# EAGLE design T05_version11_9 (EAGLE 7.1.0)
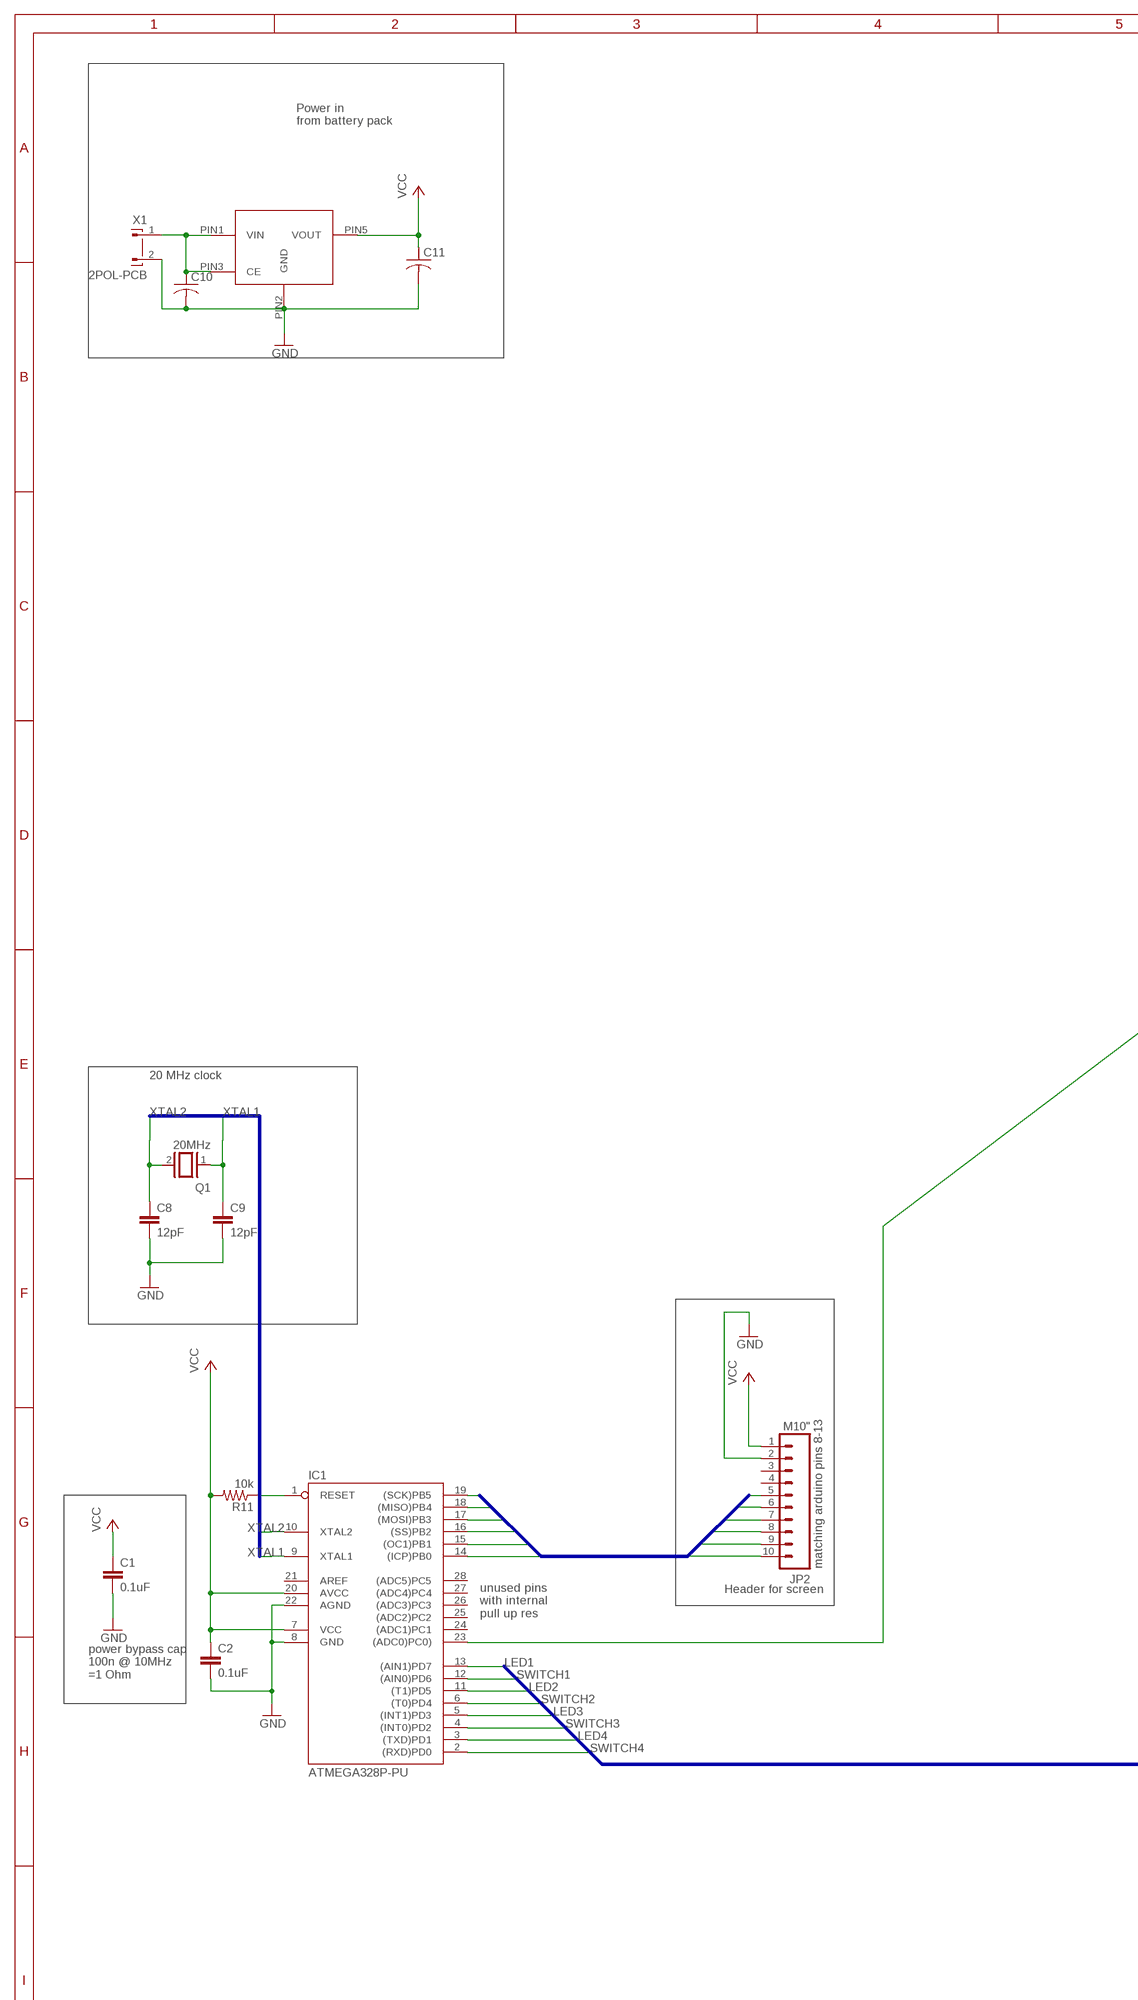
[diagram p0: schematic, sheet 1, part 1 of 2]
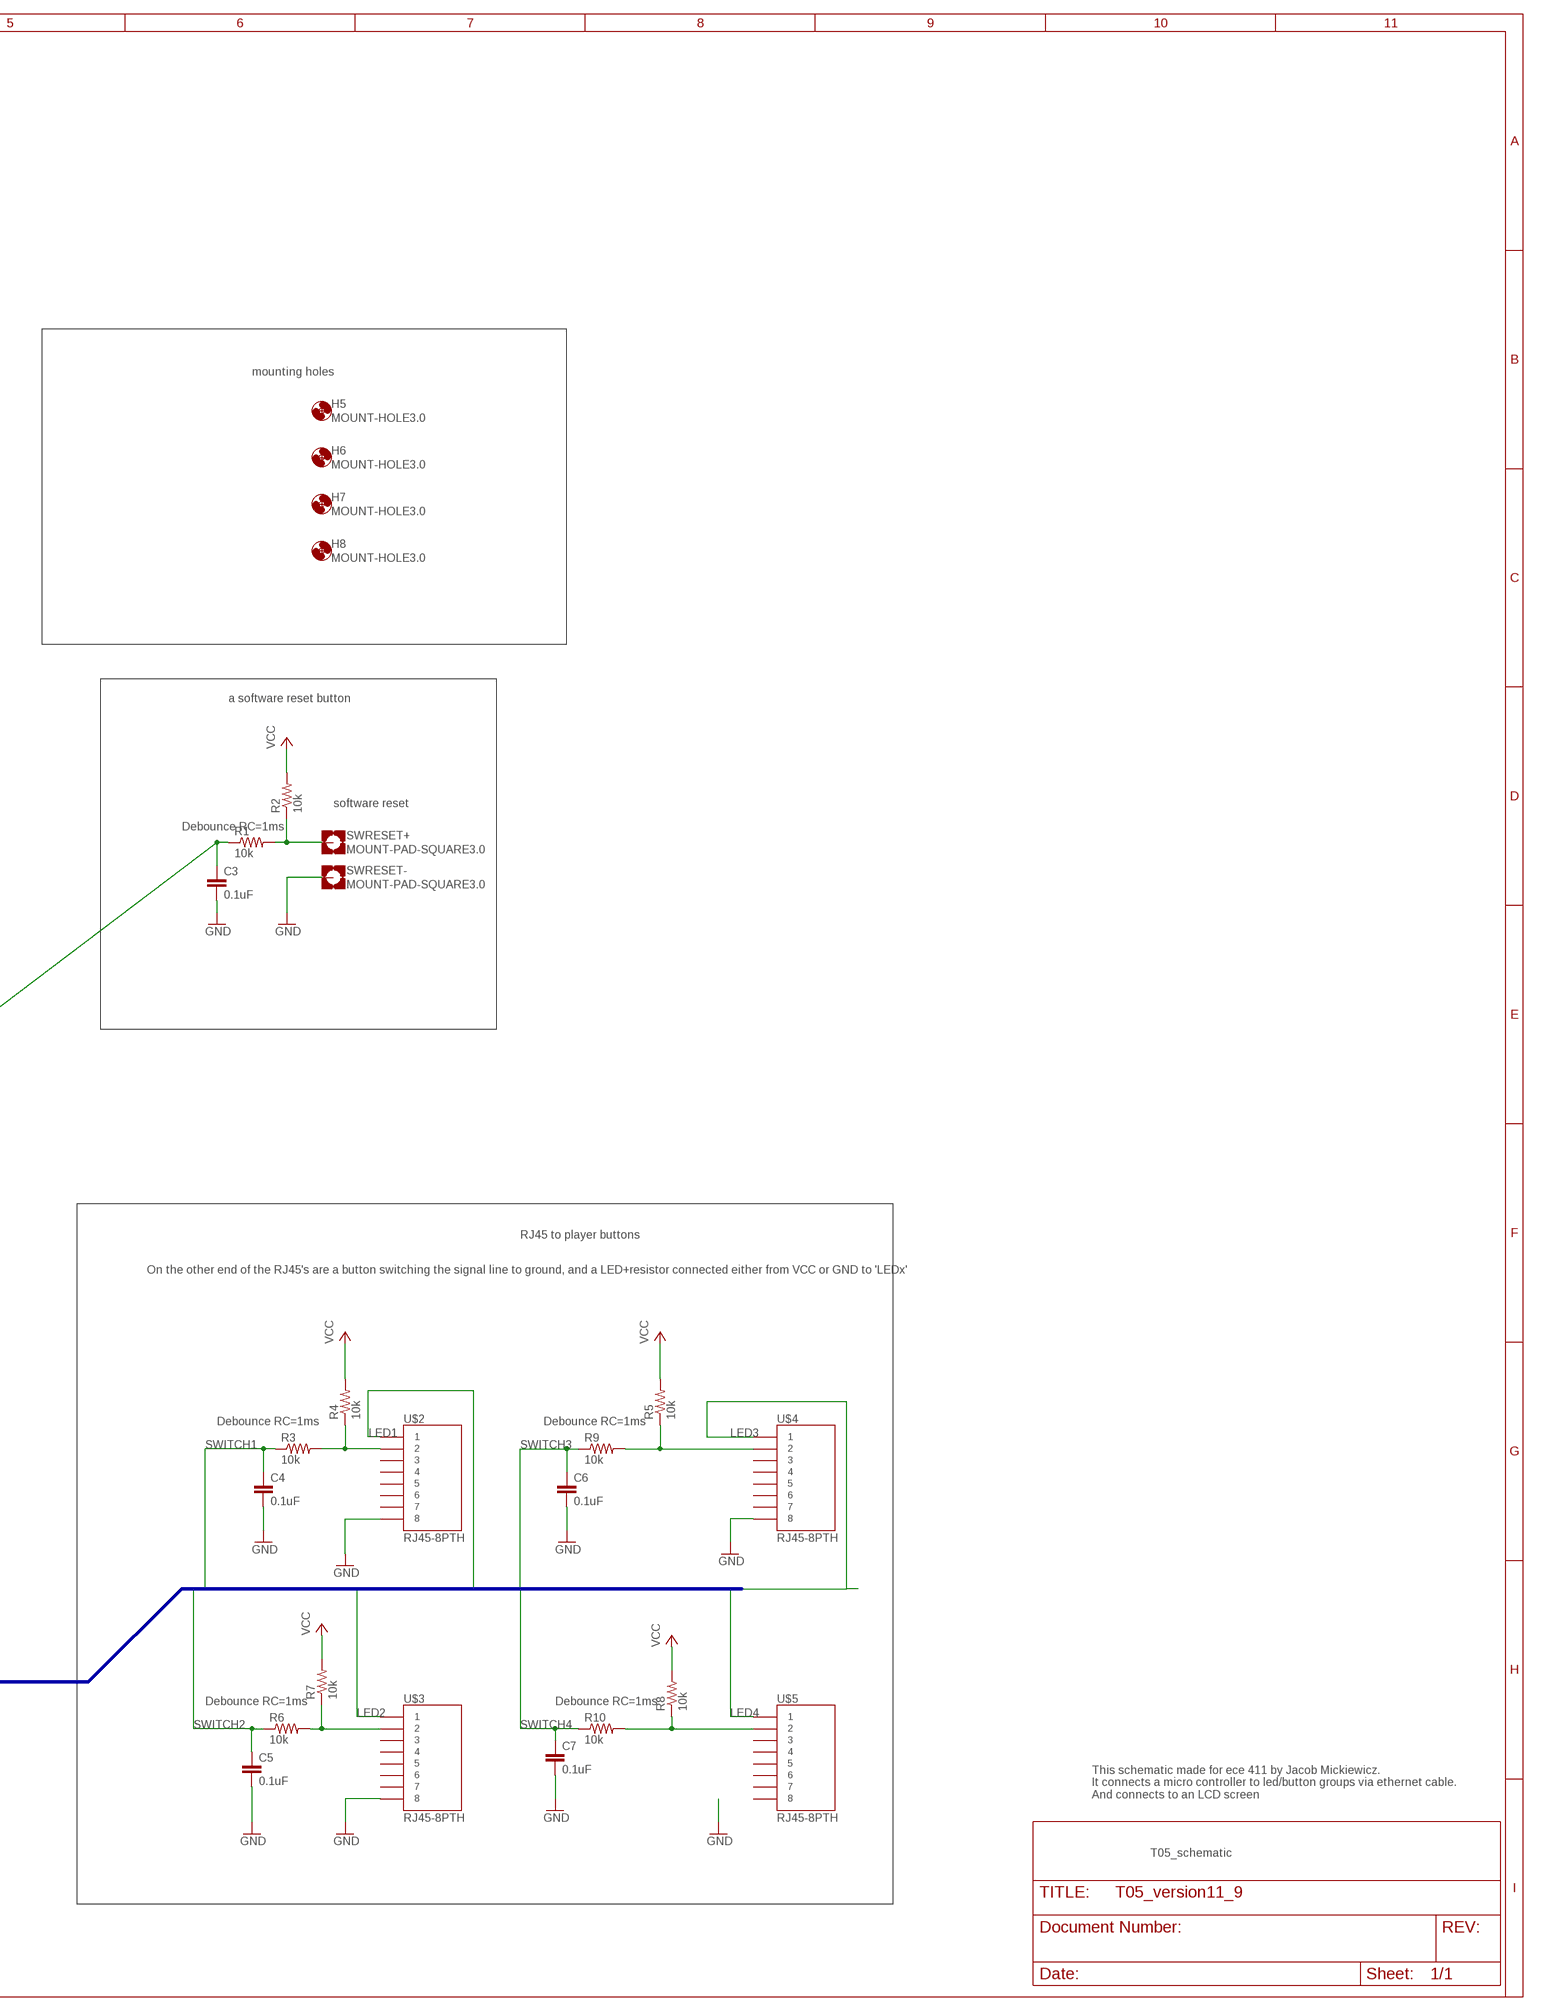
[diagram p1: schematic, sheet 1, part 2 of 2]

## Parts
C1  0.1uF  0.1UF-25V-5%(0603)  [0603-CAP]
C2  0.1uF  0.1UF-25V-5%(0603)  [0603-CAP]
C3  0.1uF  0.1UF-25V-5%(0603)  [0603-CAP]
C4  0.1uF  0.1UF-25V-5%(0603)  [0603-CAP]
C5  0.1uF  0.1UF-25V-5%(0603)  [0603-CAP]
C6  0.1uF  0.1UF-25V-5%(0603)  [0603-CAP]
C7  0.1uF  0.1UF-25V-5%(0603)  [0603-CAP]
C8  12pF  10NF/10000PF-50V-10%(0603)  [0603-CAP]
C9  12pF  10NF/10000PF-50V-10%(0603)  [0603-CAP]
C10  C-USC0603  [C0603]
C11  C-USC0603  [C0603]
H5  MOUNT-HOLE3.0  [3,0]
H6  MOUNT-HOLE3.0  [3,0]
H7  MOUNT-HOLE3.0  [3,0]
H8  MOUNT-HOLE3.0  [3,0]
IC1  ATMEGA328P-PU  [DIL28-3]
JP2  M10"  [1X10]
Q1  20MHz  XTAL/S  [QS]
R1  10k  RESISTOR0603-RES  [0603-RES]
R2  10k  RESISTOR0603-RES  [0603-RES]
R3  10k  RESISTOR0603-RES  [0603-RES]
R4  10k  RESISTOR0603-RES  [0603-RES]
R5  10k  RESISTOR0603-RES  [0603-RES]
R6  10k  RESISTOR0603-RES  [0603-RES]
R7  10k  RESISTOR0603-RES  [0603-RES]
R8  10k  RESISTOR0603-RES  [0603-RES]
R9  10k  RESISTOR0603-RES  [0603-RES]
R10  10k  RESISTOR0603-RES  [0603-RES]
R11  10k  RESISTOR0603-RES  [0603-RES]
SWRESET+  MOUNT-PAD-SQUARE3.0  [3,0-PAD-SQUARE]
SWRESET-  MOUNT-PAD-SQUARE3.0  [3,0-PAD-SQUARE]
U$1  NCP4625  [NCP4625]
U$2  RJ45-8PTH  [RJ45-8]
U$3  RJ45-8PTH  [RJ45-8]
U$4  RJ45-8PTH  [RJ45-8]
U$5  RJ45-8PTH  [RJ45-8]
X1  2POL-PCB  [2POL-PCB]

## Nets
GND: C1.2 C2.2 C3.2 C4.2 C5.2 C6.2 C7.2 C8.2 C9.2 C10.2 C11.2 IC1.8(GND) IC1.22(AGND) JP2.2 SWRESET-.B3,0(MOUNT) U$1.PIN2(GND) U$2.8 U$3.8 U$4.8 X1.2
ICP: IC1.14((ICP)PB0) JP2.10
LED1: IC1.13((AIN1)PD7) U$2.1
LED2: IC1.11((T1)PD5) U$3.1
LED3: IC1.5((INT1)PD3) U$4.1
LED4: IC1.3((TXD)PD1) U$5.1
MISO: IC1.18((MISO)PB4) JP2.6
MOSI: IC1.17((MOSI)PB3) JP2.7
N$3: IC1.1(RESET) R11.1
N$8: R3.2 R4.1 U$2.2
N$9: R8.1 R10.2 U$5.2
N$10: R1.2 R2.1 SWRESET+.B3,0(MOUNT)
N$12: R6.2 R7.1 U$3.2
N$13: R5.1 R9.2 U$4.2
N$69: C10.1 U$1.PIN1(VIN) U$1.PIN3(CE) X1.1
OC1: IC1.15((OC1)PB1) JP2.9
SCK: IC1.19((SCK)PB5) JP2.5
SS: IC1.16((SS)PB2) JP2.8
SW_RESET: C3.1 IC1.23((ADC0)PC0)) R1.1
SWITCH1: C4.1 IC1.12((AIN0)PD6) R3.1
SWITCH2: C5.1 IC1.6((T0)PD4) R6.1
SWITCH3: C6.1 IC1.4((INT0)PD2) R9.1
SWITCH4: C7.1 IC1.2((RXD)PD0) R10.1
VCC: C1.1 C2.1 C11.1 IC1.7(VCC) IC1.20(AVCC) JP2.1 R2.2 R4.2 R5.2 R7.2 R8.2 R11.2 U$1.PIN5(VOUT)
XTAL1: C9.1 IC1.9(XTAL1) Q1.1
XTAL2: C8.1 IC1.10(XTAL2) Q1.2
Unconnected: IC1.21(AREF) IC1.24((ADC1)PC1) IC1.25((ADC2)PC2) IC1.26((ADC3)PC3) IC1.27((ADC4)PC4) IC1.28((ADC5)PC5) JP2.3 JP2.4 U$2.3 U$2.4 U$2.5 U$2.6 U$2.7 U$3.3 U$3.4 U$3.5 U$3.6 U$3.7 U$4.3 U$4.4 U$4.5 U$4.6 U$4.7 U$5.3 U$5.4 U$5.5 U$5.6 U$5.7 U$5.8

## Buses
PLAYER_BUTTONS:LED[1..4],SWITCH[1..4]
PORT_B:SCK,MISO,MOSI,SS,OC1,ICP
CLOCK:XTAL[1..2]

## Notes on the sheet
- Power in
  from battery pack
- mounting holes
- a software reset button
- software reset
- Debounce RC=1ms
- 20 MHz clock
- RJ45 to player buttons
- On the other end of the RJ45's are a button switching the signal line to ground, and a LED+resistor connected either from VCC or GND to 'LEDx'
- Debounce RC=1ms | Debounce RC=1ms
- matching arduino pins 8-13
- Header for screen
- unused pins
  with internal 
  pull up res
- power bypass cap
  100n @ 10MHz
  =1 Ohm
- Debounce RC=1ms | Debounce RC=1ms
- This schematic made for ece 411 by Jacob Mickiewicz.
  It connects a micro controller to led/button groups via ethernet cable.
  And connects to an LCD screen
- T05_schematic

## Library data of the parts
C1-C7 = SparkFun-Capacitors:0.1UF-25V-5%(0603): CAP-08604; PROD_ID: CAP-08604
C8 C9 = SparkFun-Capacitors:10NF/10000PF-50V-10%(0603): CAP-00867; PROD_ID: CAP-00867; VALUE: 10nF
C10 C11 = rcl:C-US: CAPACITOR, American symbol
H5-H8 = holes:MOUNT-HOLE: MOUNTING HOLE with drill center marker
IC1 = SmartPrj:ATMEGA328P-: MICROCONTROLLER 4 Kbytes FLASH 128 bytes SRAM 256 bytes EEPROM UART 6-channel 10 bit ADC
JP2 = SparkFun-Connectors:M10: Header 10 Standard 10-pin 0.1" header. Use with straight break away headers (SKU : PRT-00116), right angle break away headers (PRT-00553), swiss pins (PRT-00743), machine pins (PRT-00117), and female headers (PRT-00115).
Q1 = special:XTAL/S: CRYSTAL
R1-R11 = SparkFun-Passives:RESISTOR: Resistor Basic schematic elements and footprints for 0603, 1206, and PTH resistors.
SWRESET+ SWRESET- = holes:MOUNT-PAD-SQUARE: MOUNTING PAD, square
U$1 = ncp4625:NCP4625
U$2-U$5 = SparkFun-Connectors:RJ45-8: RJ45 Jack Simple RJ45, 8-pin connection - connector for common Cat5, Cat5e, and Cat6 Ethernet cables. Footprint not yet proven in production. Connector sku is PRT-00643; Breakout PCB sku is BOB-00716.
X1 = con-friwo:2POL-PCB: PCB SUPPLY CONNECTOR FRIWO (TEXAS); OC_FARNELL: unknown; OC_NEWARK: unknown

## Net classes
0 default: width 0.254 mm, clearance 0.254 mm
1 vcc: width 1.27 mm, clearance 0.254 mm to class 0, clearance 0.254 mm
2 gnd: width 0.254 mm, clearance 0.508 mm to class 0, clearance 0.254 mm to class 1, clearance 0.254 mm

## Board
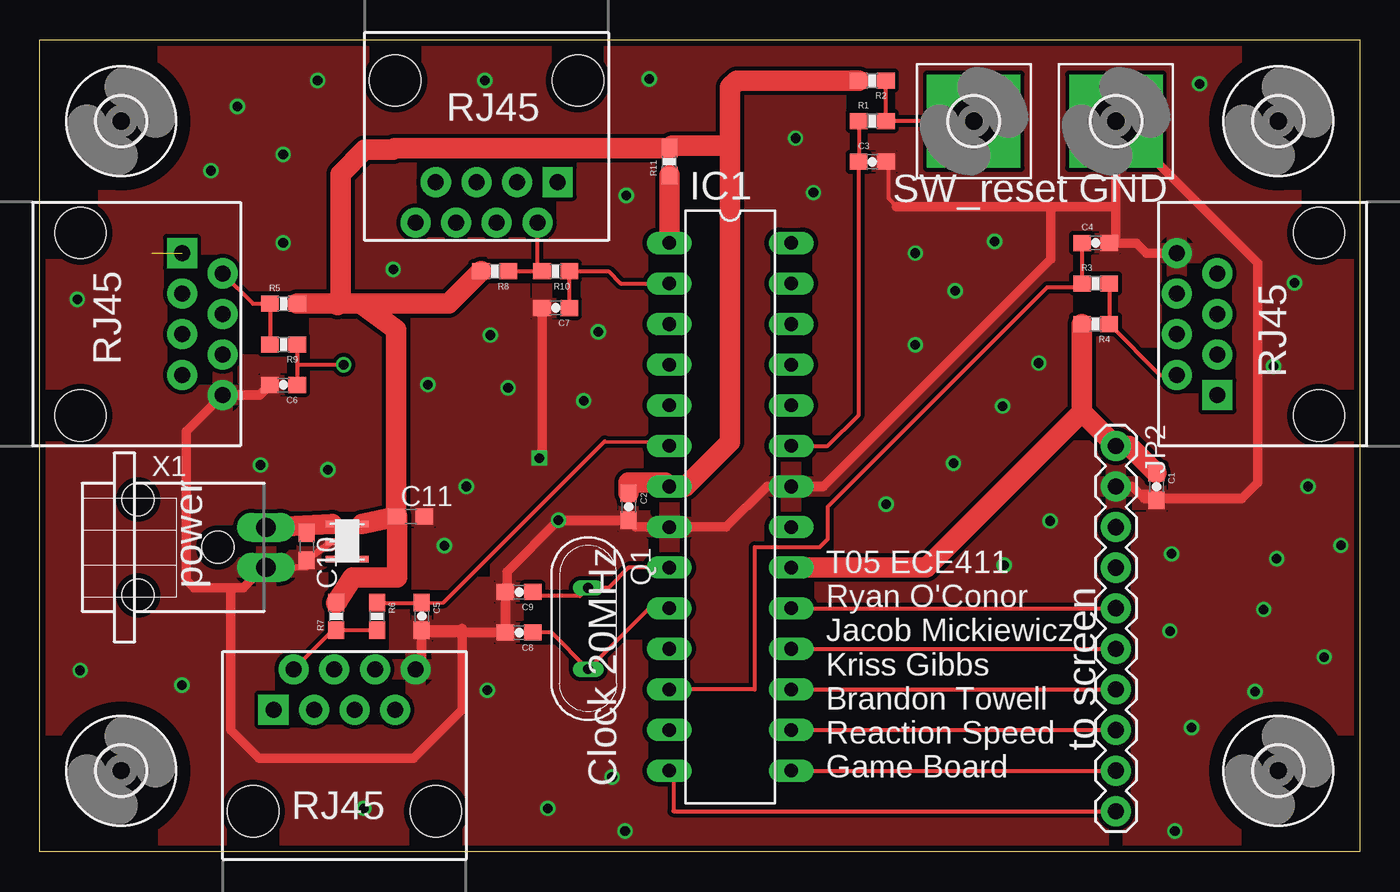
[diagram p2: board, top side]
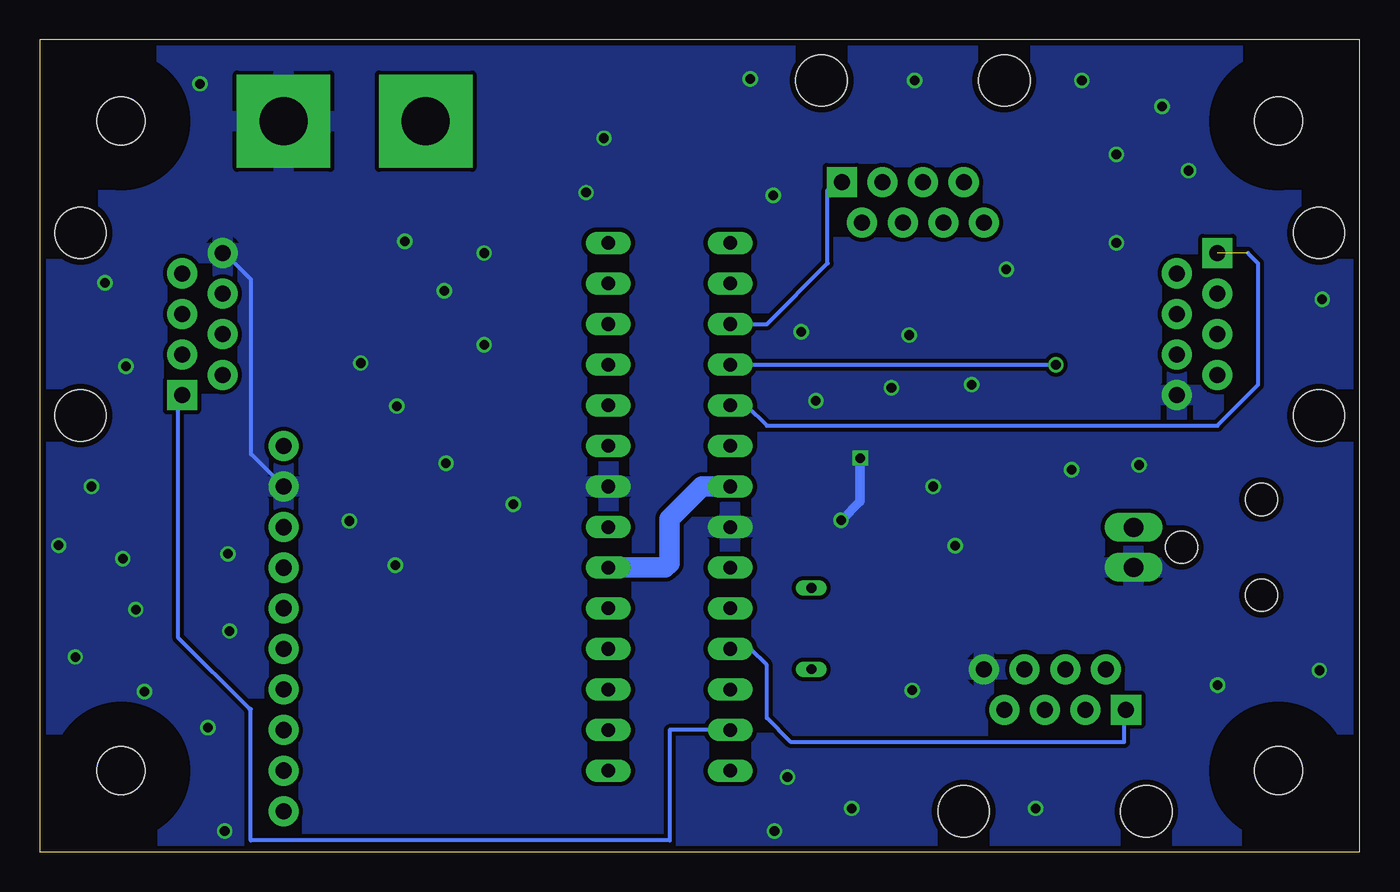
[diagram p3: board, bottom side, seen from below]

Size 82.55 x 50.8 mm. Coordinates in mm from the lower left corner, seen from the top.
Outline: 0,50.8 82.55,50.8 82.55,0 0,0 0,50.8
Copper layers (1*16): Top 0.0356mm / dielectric 1.5011mm / Bottom 0.0356mm
Design rules "OSH-Park-2-layer *": minimum track width 6mil, minimum drill 13mil, track to track 6mil, track to pad 6mil, pad to pad 6mil, via to via 6mil, smd to smd 6mil, copper to edge 15mil, drill to drill 10mil, minimum pad ring 7mil, minimum via ring 7mil, stop-mask expansion 3mil, vias tented up to drill 0mil, thermal gap 10mil

### Footprints (pad centres in the part's own frame; a part is rotated, then mirrored left to right if it is on the bottom)
0603-CAP = smd 1.1 x 1: 1 -0.85,0; 2 0.85,0
C0603 = smd 1.1 x 1: 1 -0.85,0; 2 0.85,0
3,0 = hole 3: 0,0
DIL28-3 = drill 0.85 pad 1.422 long: 1 -16.51,-3.81; 2 -13.97,-3.81; 3 -11.43,-3.81; 4 -8.89,-3.81; 5 -6.35,-3.81; 6 -3.81,-3.81; 7 -1.27,-3.81; 8 1.27,-3.81; 9 3.81,-3.81; 10 6.35,-3.81; 11 8.89,-3.81; 12 11.43,-3.81; 13 13.97,-3.81; 14 16.51,-3.81; 15 16.51,3.81; 16 13.97,3.81; 17 11.43,3.81; 18 8.89,3.81; 19 6.35,3.81; 20 3.81,3.81; 21 1.27,3.81; 22 -1.27,3.81; 23 -3.81,3.81; 24 -6.35,3.81; 25 -8.89,3.81; 26 -11.43,3.81; 27 -13.97,3.81; 28 -16.51,3.81
1X10 = drill 1.016 pad 1.88: 1 0,0; 2 2.54,0; 3 5.08,0; 4 7.62,0; 5 10.16,0; 6 12.7,0; 7 15.24,0; 8 17.78,0; 9 20.32,0; 10 22.86,0
QS = drill 0.61 long: 1 -2.54,0; 2 2.54,0
0603-RES = smd 1.1 x 1: 1 -0.85,0; 2 0.85,0
3,0-PAD-SQUARE = drill 3 pad 5.842 square: B3,0 0,0
NCP4625 = smd 0.813 x 0.406: PIN1 -0.2,2.4; PIN2 -0.2,1.3; PIN3 -0.2,0.2; PIN4 1.7,0.2; PIN5 1.7,2.4
RJ45-8 = drill 1 pad 1.88 square: 1 -4.445,6.35 | drill 1 pad 1.88: 2 -3.175,8.89; 3 -1.905,6.35; 4 -0.635,8.89; 5 0.635,6.35; 6 1.905,8.89; 7 3.175,6.35; 8 4.445,8.89 | hole 3.2: -5.715,0; 5.715,0
2POL-PCB = drill 1.2 long: 1 -1.25,11.6; 2 1.25,11.6 | hole 2: -3,3.6; 3,3.6; 0,8.6

### Placement (x,y rotation side)
C1  69.85,22.86 270 top
C2  36.83,21.59 270 top
C3  52.07,43.18 0 top
C4  66.04,38.1 0 top
C5  23.88,14.73 270 top
C6  15.24,29.21 180 top
C7  32.26,34.04 180 top
C8  29.97,13.72 180 top
C9  29.97,16.26 180 top
C10  16.69,19.1 270 top
C11  23.19,20.98 0 top
H5  77.47,5.08 0 top
H6  77.47,45.72 0 top
H7  5.08,45.72 0 top
H8  5.08,5.08 0 top
IC1  43.18,21.59 270 top
JP2  67.31,25.4 270 top
Q1  34.29,13.97 270 top
R1  52.07,45.72 0 top
R2  52.07,48.26 180 top
R3  66.04,35.56 0 top
R4  66.04,33.02 180 top
R5  15.24,34.29 0 top
R6  21.08,14.73 270 top
R7  18.54,14.73 90 top
R8  28.45,36.32 180 top
R9  15.24,31.75 180 top
R10  32.26,36.32 180 top
R11  39.37,43.18 90 top
SWRESET+  58.42,45.72 0 top
SWRESET-  67.31,45.72 0 top
U$1  18.47,18.11 0 top
U$2  80.01,33.02 90 top
U$3  19.05,2.54 0 top
U$4  2.54,33.02 270 top
U$5  27.94,48.26 180 top
X1  2.54,19.05 270 top

### Tracks (layer width: path | path; a pad name or v marks a point on that pad's centre or on a via)
GND  (via drill 0.6)
  Top 0.254: C4.2 67.31,38.52 | C3.2 53.09,43.01 53.09,40.89 53.59,40.39 | C1.2 69.51,22.35 | C2.2 37.25,20.32 | U$3.8 23.88,11.81 | C5.2 24.04,13.72
  Top 0.406: 13.99,17.8 16.69,17.8 C10.2 U$1.PIN2
  Top 0.61: C6.2 13.76,28.57 U$4.8 9.14,26.29 9.14,17.02 9.65,16.51 11.94,16.51 | 11.94,16.51 12.7,16.51 13.99,17.8 | C4.2 68.58,38.1 69.22,37.47 U$2.8 | 67.31,38.52 67.31,40.39 | 67.31,40.39 SWRESET-.B3,0 76.2,36.83 76.2,23.11 75.18,22.1 69.09,22.1 68.83,22.35 | 53.59,40.39 62.99,40.39 | 62.99,40.39 67.31,40.39 | 69.51,22.35 68.83,22.35 | 68.83,22.35 68.33,22.86 JP2.2 | 37.25,20.32 IC1.8 42.93,20.32 45.47,22.86 IC1.22 49.02,22.86 63.25,37.08 63.25,40.13 62.99,40.39 | 23.88,11.81 C5.2 26.33,13.88 26.42,13.97 26.42,8.89 23.37,5.84 13.72,5.84 11.94,7.62 11.94,16.51 | 24.04,13.72 C8.2 C9.2 29.21,16.34 29.21,17.53 v32.44,20.75 32.42,20.74 C2.2 | C7.2 31.41,24.8 v31.24,24.64
  Bottom 0.254: JP2.2 69.34,24.89 69.34,35.81 70.61,37.08 70.61,37.47 U$2.8
  Bottom 0.61: v31.24,24.64 31.24,21.92 32.42,20.74
  other vias: 26.67,22.86 8.89,10.44 2.51,11.35 31.78,2.72 20.27,2.72 35.79,4.67 27.99,10.11 25.3,19.15 18.01,23.9 13.79,24.21 24.26,29.24 29.29,29.03 34.01,28.22 34.92,32.54 28.17,32.33 22.1,36.45 36.68,41.07 15.21,38.1 15.21,43.64 10.69,42.62 12.34,46.63 17.37,48.26 27.84,48.26 38.13,48.36 47.27,44.65 48.39,41.25 54.76,37.47 54.76,31.72 57.25,35.1 59.72,38.2 72.54,48.06 78.49,35.61 77.17,30.38 79.32,22.86 81.38,19.18 80.34,12.19 76.02,10.03 36.6,1.3 70.99,1.3 72.03,7.77 70.69,13.82 76.56,15.16 77.37,18.34 70.79,18.64 63.2,20.7 60.33,17.93 62.48,30.58 60.22,27.89 57.15,24.31 52.93,21.74 2.34,34.57
  pour Bottom (isolate 0.254): 0,50.8 82.55,50.8 82.55,0 0,0
  pour Top (isolate 0.254): 0,50.8 82.55,50.8 82.55,0 0,0
ICP
  Top 0.254: IC1.14 39.62,4.83 39.62,2.54 JP2.10
LED1
  Bottom 0.254: IC1.13 43.16,7.62 43.16,0.71 69.37,0.71 69.37,8.94 69.44,8.94 73.89,13.39 73.89,28.35 U$2.1
LED2
  Bottom 0.254: U$3.1 14.73,8.76 14.73,6.86 35.56,6.86 37.08,8.38 37.08,11.68 38.1,12.7 IC1.11
LED3  (1 unrouted)
  Bottom 0.254: 6.99,37.47 6.35,36.83 6.35,29.21 8.89,26.67 37.08,26.67 38.35,27.94 IC1.5
LED4
  Bottom 0.254: IC1.3 37.08,33.02 33.27,36.83 33.27,41.4 32.77,41.91 U$5.1
MISO
  Top 0.254: IC1.18 JP2.6
MOSI
  Top 0.254: IC1.17 JP2.7
N$3
  Top 1.27: IC1.1 R11.1
N$8
  Top 0.254: R3.2 R4.1 70.06,29.84 U$2.2
N$9
  Top 0.254: R8.1 R10.2 31.11,36.62 U$5.2
N$10
  Top 0.254: SWRESET+.B3,0 R1.2 R2.1
N$12
  Top 0.254: U$3.2 18.33,13.88 R7.1 R6.2
N$13
  Top 0.254: R9.2 R5.1 13.34,34.29 U$4.2
N$69
  Top 0.254: U$1.PIN3 19.28,19.02 19.28,19.74 U$1.PIN1 C10.1
  Top 1.27: U$1.PIN1 X1.1
OC1
  Top 0.254: IC1.15 JP2.9
SCK
  Top 0.254: IC1.19 JP2.5
SS
  Top 0.254: IC1.16 JP2.8
SW_RESET
  Top 0.254: R1.1 C3.1 51.22,27.34 49.28,25.4 IC1.23
SWITCH1
  Top 0.254: C4.1 R3.1 64.94,35.31 62.99,35.31 49.28,21.59 49.28,19.56 48.77,19.05 44.7,19.05 44.7,10.16 IC1.12
SWITCH2
  Top 0.254: R6.1 C5.1 25.26,15.61 35.33,25.68 39.12,25.65 IC1.6
SWITCH3  (via drill 0.6)
  Top 0.254: R9.1 16.09,30.5 | 16.09,30.5 C6.1 | 16.09,30.5 18.97,30.5
  Top 0.406: 18.97,30.5 v19,30.48
  Bottom 0.254: IC1.4 v19,30.48
  Bottom 0.406: v19,30.48 19,30.5
SWITCH4
  Top 0.254: C7.1 R10.1 35.56,36.32 36.32,35.56 IC1.2
VCC
  Top 0.254: C11.1 22.28,21.23
  Top 1.27: 65.19,27.52 JP2.1 68.16,25.4 C1.1 | 65.19,27.52 R4.2 | C2.1 36.83,23.11 39.12,23.11 IC1.7 40.39,22.86 43.18,25.65 43.18,44.2 | R2.2 43.6,48.26 43.18,47.84 43.18,44.2 | 43.18,44.2 39.54,44.2 R11.2 22.19,44.03 22.1,43.94 20.32,43.94 18.8,42.42 18.8,34.54 19.05,34.29 | R5.2 18.54,34.29 | 18.54,34.29 19.05,34.29 | 19.05,34.29 20.07,34.29 | 20.07,34.29 25.57,34.29 R8.2 | 18.63,34.2 18.54,34.29 | 22.28,21.23 22.28,32.66 20.07,34.29 | 18.63,15.67 R7.2 19.56,17.17 22.35,17.17 C11.1 U$1.PIN5 | IC1.20 55.45,17.78 65.19,27.52
  Bottom 1.27: IC1.20 43.43,17.78 43.18,18.03 43.18,20.83 41.15,22.86 IC1.7
XTAL1
  Top 0.254: IC1.9 36.83,17.78 35.56,16.51 Q1.1 33.78,16 31.24,16 30.99,16.26 C9.1
XTAL2
  Top 0.254: IC1.10 38.1,15.24 Q1.2 32,13.72 C8.1

### Text on the board
tPlace: SW_reset GND | Clock 20MHz | to screen | T05 ECE411 / Ryan O'Conor / Jacob Mickiewicz / Kriss Gibbs / Brandon Towell / Reaction Speed / Game Board
tSilk: RJ45 | RJ45 | RJ45 | power | RJ45